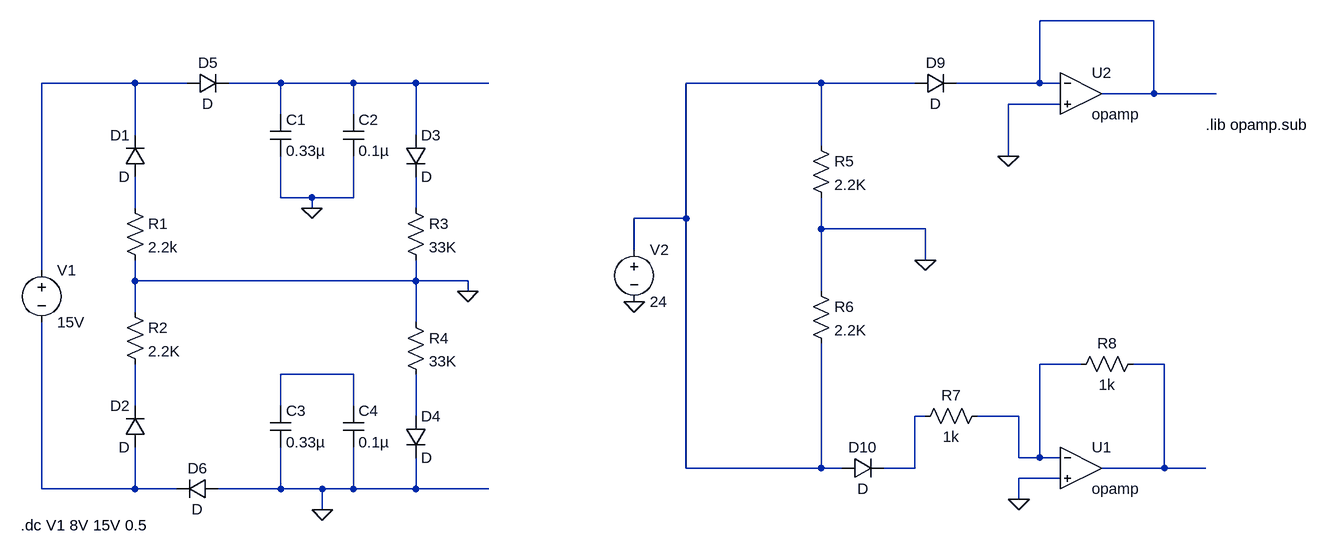
[diagram p0: schematic stage-1-PowerProtection.asc]
stage-1-PowerProtection.asc, the LTspice schematic file:
Version 4
SHEET 1 1956 680
WIRE 1680 -240 1504 -240
WIRE 112 -144 -32 -144
WIRE 192 -144 112 -144
WIRE 336 -144 256 -144
WIRE 448 -144 336 -144
WIRE 544 -144 448 -144
WIRE 656 -144 544 -144
WIRE 1168 -144 960 -144
WIRE 1312 -144 1168 -144
WIRE 1504 -144 1504 -240
WIRE 1504 -144 1376 -144
WIRE 1536 -144 1504 -144
WIRE 1680 -128 1680 -240
WIRE 1680 -128 1600 -128
WIRE 1776 -128 1680 -128
WIRE 1536 -112 1456 -112
WIRE 336 -96 336 -144
WIRE 448 -96 448 -144
WIRE 112 -64 112 -144
WIRE 544 -64 544 -144
WIRE 1168 -48 1168 -144
WIRE 1456 -32 1456 -112
WIRE 336 32 336 -32
WIRE 384 32 336 32
WIRE 448 32 448 -32
WIRE 448 32 384 32
WIRE 112 48 112 0
WIRE 384 48 384 32
WIRE 544 48 544 0
WIRE 960 64 960 -144
WIRE 960 64 880 64
WIRE 1168 80 1168 32
WIRE 1328 80 1168 80
WIRE 880 112 880 64
WIRE 1328 128 1328 80
WIRE -32 144 -32 -144
WIRE 112 160 112 128
WIRE 544 160 544 128
WIRE 544 160 112 160
WIRE 624 160 544 160
WIRE 624 176 624 160
WIRE 1168 176 1168 80
WIRE 112 208 112 160
WIRE 544 224 544 160
WIRE 1568 288 1504 288
WIRE 1696 288 1648 288
WIRE 448 304 336 304
WIRE 112 352 112 288
WIRE 336 352 336 304
WIRE 448 352 448 304
WIRE 544 368 544 304
WIRE 1328 368 1312 368
WIRE 1472 368 1408 368
WIRE 1472 432 1472 368
WIRE 1504 432 1504 288
WIRE 1504 432 1472 432
WIRE 1536 432 1504 432
WIRE 960 448 960 64
WIRE 1168 448 1168 256
WIRE 1168 448 960 448
WIRE 1200 448 1168 448
WIRE 1312 448 1312 368
WIRE 1312 448 1264 448
WIRE 1696 448 1696 288
WIRE 1696 448 1600 448
WIRE 1760 448 1696 448
WIRE 1536 464 1472 464
WIRE -32 480 -32 224
WIRE 112 480 112 416
WIRE 112 480 -32 480
WIRE 176 480 112 480
WIRE 336 480 336 416
WIRE 336 480 240 480
WIRE 400 480 336 480
WIRE 448 480 448 416
WIRE 448 480 400 480
WIRE 544 480 544 432
WIRE 544 480 448 480
WIRE 656 480 544 480
WIRE 1472 496 1472 464
WIRE 400 512 400 480
FLAG 384 48 0
FLAG 400 512 0
FLAG 624 176 0
FLAG 880 192 0
FLAG 1472 496 0
FLAG 1456 -32 0
FLAG 1328 128 0
SYMBOL res 96 32 R0
SYMATTR InstName R1
SYMATTR Value 2.2k
SYMBOL res 96 192 R0
SYMATTR InstName R2
SYMATTR Value 2.2K
SYMBOL res 528 32 R0
SYMATTR InstName R3
SYMATTR Value 33K
SYMBOL res 528 208 R0
SYMATTR InstName R4
SYMATTR Value 33K
SYMBOL diode 128 0 R180
WINDOW 0 24 64 Left 2
WINDOW 3 24 0 Left 2
SYMATTR InstName D1
SYMBOL diode 128 416 R180
WINDOW 0 24 64 Left 2
WINDOW 3 24 0 Left 2
SYMATTR InstName D2
SYMBOL diode 528 -64 R0
SYMATTR InstName D3
SYMBOL diode 528 368 R0
SYMATTR InstName D4
SYMBOL diode 192 -128 R270
WINDOW 0 32 32 VTop 2
WINDOW 3 0 32 VBottom 2
SYMATTR InstName D5
SYMBOL diode 240 464 R90
WINDOW 0 0 32 VBottom 2
WINDOW 3 32 32 VTop 2
SYMATTR InstName D6
SYMBOL cap 320 -96 R0
SYMATTR InstName C1
SYMATTR Value 0.33µ
SYMBOL cap 432 -96 R0
SYMATTR InstName C2
SYMATTR Value 0.1µ
SYMBOL cap 320 352 R0
SYMATTR InstName C3
SYMATTR Value 0.33µ
SYMBOL cap 432 352 R0
SYMATTR InstName C4
SYMATTR Value 0.1µ
SYMBOL voltage -32 128 R0
WINDOW 123 0 0 Left 0
WINDOW 39 0 0 Left 0
SYMATTR InstName V1
SYMATTR Value 15V
SYMBOL voltage 880 96 R0
WINDOW 123 0 0 Left 0
WINDOW 39 0 0 Left 0
SYMATTR InstName V2
SYMATTR Value 24
SYMBOL res 1152 -64 R0
SYMATTR InstName R5
SYMATTR Value 2.2K
SYMBOL res 1152 160 R0
SYMATTR InstName R6
SYMATTR Value 2.2K
SYMBOL OpAmps\\opamp 1568 384 R0
SYMATTR InstName U1
SYMBOL res 1424 352 R90
WINDOW 0 0 56 VBottom 2
WINDOW 3 32 56 VTop 2
SYMATTR InstName R7
SYMATTR Value 1k
SYMBOL res 1664 272 R90
WINDOW 0 0 56 VBottom 2
WINDOW 3 32 56 VTop 2
SYMATTR InstName R8
SYMATTR Value 1k
SYMBOL OpAmps\\opamp 1568 -192 R0
SYMATTR InstName U2
SYMBOL diode 1312 -128 R270
WINDOW 0 32 32 VTop 2
WINDOW 3 0 32 VBottom 2
SYMATTR InstName D9
SYMBOL diode 1200 464 R270
WINDOW 0 32 32 VTop 2
WINDOW 3 0 32 VBottom 2
SYMATTR InstName D10
TEXT -64 536 Left 2 !.dc V1 8V 15V 0.5
TEXT 1760 -80 Left 2 !.lib opamp.sub

The netlist it stands for:
* stage-1-PowerProtection.asc
R1 N005 0 2.2k
R2 0 N010 2.2K
R3 N006 0 33K
R4 0 N011 33K
D1 N005 N002 D
D2 N013 N010 D
D3 N003 N006 D
D4 N011 0 D
D5 N002 N003 D
D6 0 N013 D
C1 N003 0 0.33µ
C2 N003 0 0.1µ
C3 N009 0 0.33µ
C4 N009 0 0.1µ
V1 N002 N013 15V
V2 N004 0 24
R5 N004 0 2.2K
R6 0 N004 2.2K
XU1 N007 0 N008 opamp Aol=100K GBW=10Meg  ; pins invin noninvin out
R7 N007 N012 1k
R8 N008 N007 1k
XU2 N001 0 N001 opamp Aol=100K GBW=10Meg  ; pins invin noninvin out
D9 N004 N001 D
D10 N004 N012 D
.model D D
.lib standard.dio
.dc V1 8V 15V 0.5
.lib opamp.sub
.backanno
.end